# EAGLE design ESPLed (EAGLE 8.2.2)
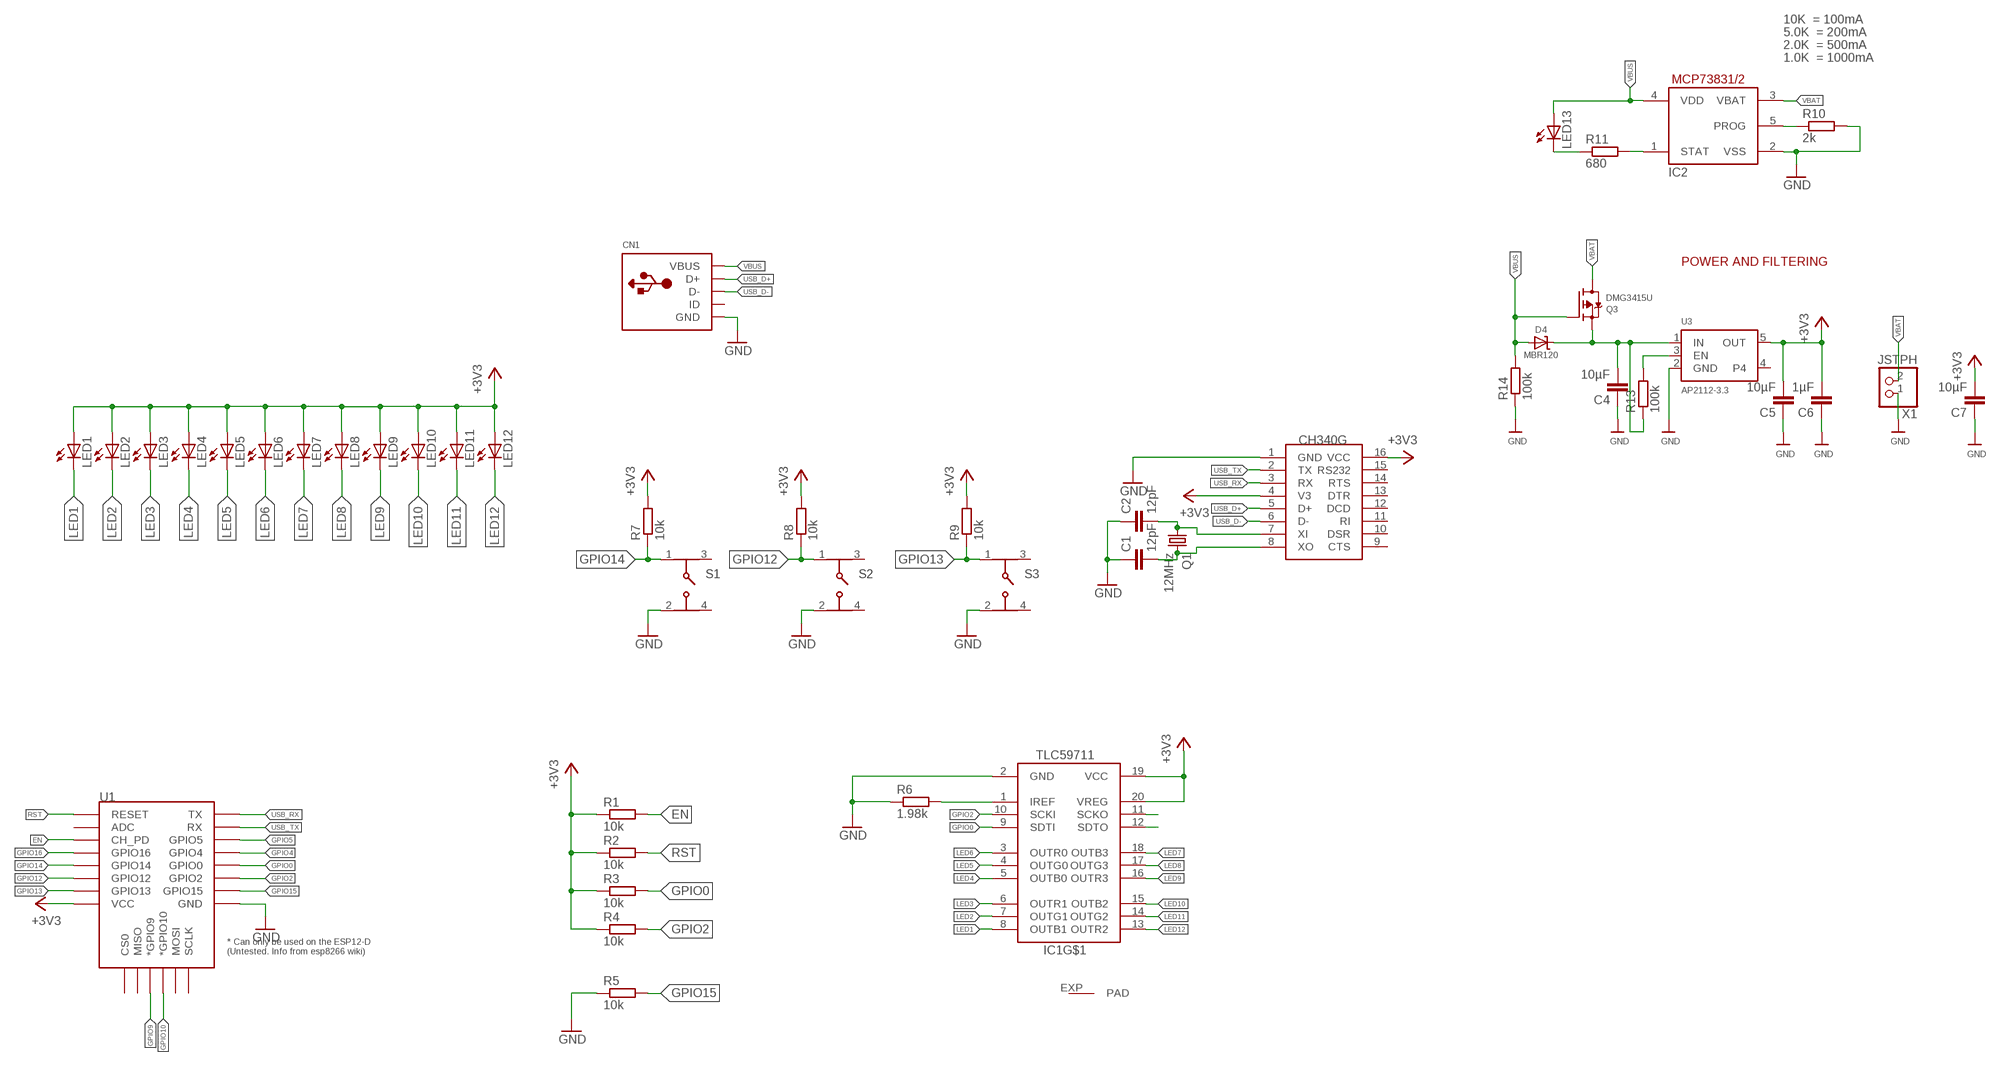
[diagram p0: schematic, sheet 1]

## Parts
C1  12pF  C-EUC0805  [C0805]
C2  12pF  C-EUC0805  [C0805]
C4  10µF  C-EUC0805  [C0805]
C5  10µF  C-EUC0805  [C0805]
C6  1µF  C-EUC0805  [C0805]
C7  10µF  C-EUC0805  [C0805]
CN1  USBMINIB  [USB-MINIB]
D4  MBR120  DIODE-SCHOTTKYSOD-123  [SOD-123]
IC1  TLC59711  [HTSSOP20DAP]
IC2  MCP73831/OT  [SOT23-5L]
LED1  LEDSML0805  [SML0805]
LED2  LEDSML0805  [SML0805]
LED3  LEDSML0805  [SML0805]
LED4  LEDSML0805  [SML0805]
LED5  LEDSML0805  [SML0805]
LED6  LEDSML0805  [SML0805]
LED7  LEDSML0805  [SML0805]
LED8  LEDSML0805  [SML0805]
LED9  LEDSML0805  [SML0805]
LED10  LEDSML0805  [SML0805]
LED11  LEDSML0805  [SML0805]
LED12  LEDSML0805  [SML0805]
LED13  LEDSML0805  [SML0805]
Q1  12MHz  CX5032GB12000H0PESZZ  [CX5032GB]
Q3  DMG3415U  MOSFET-P  [SOT23-R]
R1  10k  R-EU_R0805  [R0805]
R2  10k  R-EU_R0805  [R0805]
R3  10k  R-EU_R0805  [R0805]
R4  10k  R-EU_R0805  [R0805]
R5  10k  R-EU_R0805  [R0805]
R6  1.98k  R-EU_R0805  [R0805]
R7  10k  R-EU_R0805  [R0805]
R8  10k  R-EU_R0805  [R0805]
R9  10k  R-EU_R0805  [R0805]
R10  2k  R-EU_R0805  [R0805]
R11  680  R-EU_R0805  [R0805]
R13  100k  R-EU_R0805  [R0805]
R14  100k  R-EU_R0805  [R0805]
S1  4301X6XXX7X6_430156043726  [4301X6XXX7X6]
S2  4301X6XXX7X6_430156043726  [4301X6XXX7X6]
S3  4301X6XXX7X6_430156043726  [4301X6XXX7X6]
U1  ESP12ESMD  [ESP12E-SMD]
U3  AP2112-3.3  VREG_SOT23-5  [SOT23-5]
U$1  CH340G  [SOIC16]
X1  JSTPH  CON_JST_PH_2PIN  [JSTPH2]

## Nets
+3V3: C5.2 C6.2 C7.2 IC1.19(VCC) IC1.20(VREG) LED1.A LED2.A LED3.A LED4.A LED5.A LED6.A LED7.A LED8.A LED9.A LED10.A LED11.A LED12.A R1.1 R2.1 R3.1 R4.1 R7.2 R8.2 R9.2 U1.VCC U3.5(OUT) U$1.4(V3) U$1.16(VCC)
EN: R1.2 U1.CH_PD
GND: C1.1 C2.1 C4.1 C5.1 C6.1 C7.1 CN1.GND IC1.2(GND) IC2.2(VSS) R5.1 R6.1 R10.2 R14.1 S1.2 S2.2 S3.2 U1.GND U3.2(GND) U$1.1(GND) X1.1
GPIO0: IC1.9(SDTI) R3.2 U1.GPIO0
GPIO2: IC1.10(SCKI) R4.2 U1.GPIO2
GPIO4: U1.GPIO4
GPIO5: U1.GPIO5
GPIO9: U1.GPIO9(*GPIO9)
GPIO10: U1.GPIO10(*GPIO10)
GPIO12: R8.1 S2.1 U1.GPIO12
GPIO13: R9.1 S3.1 U1.GPIO13
GPIO14: R7.1 S1.1 U1.GPIO14
GPIO15: R5.2 U1.GPIO15
GPIO16: U1.GPIO16
IN: C4.2 D4.C Q3.2(S) R13.1 U3.1(IN)
IREF: IC1.1(IREF) R6.2
LED1: IC1.8(OUTB1) LED1.C
LED2: IC1.7(OUTG1) LED2.C
LED3: IC1.6(OUTR1) LED3.C
LED4: IC1.5(OUTB0) LED4.C
LED5: IC1.4(OUTG0) LED5.C
LED6: IC1.3(OUTR0) LED6.C
LED7: IC1.18(OUTB3) LED7.C
LED8: IC1.17(OUTG3) LED8.C
LED9: IC1.16(OUTR3) LED9.C
LED10: IC1.15(OUTB2) LED10.C
LED11: IC1.14(OUTG2) LED11.C
LED12: IC1.13(OUTR2) LED12.C
N$1: LED13.C R11.1
N$14: IC1.12(SDTO)
N$15: IC1.11(SCKO)
PROG: IC2.5(PROG) R10.1
RST: R2.2 U1.RESET
STAT: IC2.1(STAT) R11.2
USB_D+: CN1.D+ U$1.5(D+)
USB_D-: CN1.D- U$1.6(D-)
USB_RX: U1.TXD0(TX) U$1.3(RX)
USB_TX: U1.RXD0(RX) U$1.2(TX)
VBAT: IC2.3(VBAT) Q3.3(D) X1.2
VBUS: CN1.VBUS D4.A IC2.4(VDD) LED13.A Q3.1(G) R14.2
VREG_EN: R13.2 U3.3(EN)
XI: C2.2 Q1.P$1 U$1.7(XI)
XO: C1.2 Q1.P$2 U$1.8(XO)
Unconnected: CN1.ID IC1.EXP(PAD) S1.3 S1.4 S2.3 S2.4 S3.3 S3.4 U1.ADC U1.CS0 U1.MISO U1.MOSI U1.SCLK U3.4 U$1.9(CTS) U$1.10(DSR) U$1.11(RI) U$1.12(DCD) U$1.13(DTR) U$1.14(RTS) U$1.15(RS232)

## Notes on the sheet
- 10K  = 100mA
- 5.0K  = 200mA
- 2.0K  = 500mA
- 1.0K  = 1000mA
- POWER AND FILTERING

## Library data of the parts
C1 C2 C4-C7 = resistor:C-EU: CAPACITOR, European symbol
CN1 = adafruit:USB: USB Connectors USBMINIB - Surface Mount Female Mini-B USB Connector 4UConnector: 06564 By microbuilder.eu Thru-hole RA Female Mini-B USB Connector 4UConnector: 18732 By ladyada.net
D4 = microbuilder:DIODE-SCHOTTKY
IC1 = adafruit:TLC59711
IC2 = adafruit:MCP73831: MCP73831/2 Miniature Single-Cell, Fully Integrated Li-Ion, Li-Polymer Charge Management Controllers. Nice and small simple lipoly charge controller, with adjustable current and status output (LED) http://www.ladyada.net/library/pcb/eaglelibrary.html
LED1-LED13 = led:LED: LED OSRAM: - CHIPLED LG R971, LG N971, LY N971, LG Q971, LY Q971, LO R971, LY R971 LH N974, LH R974 LS Q976, LO Q976, LY Q976 LO Q996 - Hyper CHIPLED LW Q18S LB Q993, LB Q99A, LB R99A - SideLED LS A670, LO A670, LY A670, LG A670, LP A670 LB A673, LV A673, LT A673, LW A673 LH A674 LY A675 LS A676, LA A676, LO A676, LY A676, LW A676 LS A679, LY A679, LG A679 - Hyper Micro SIDELED® LS Y876, LA Y876, LO Y876, LY Y876 LT Y87S - SmartLED LW L88C, LW L88S LB L89C, LB L89S, LG L890 LS L89K, LO L89K, LY L89K LS L896, LA L896, LO L896, LY L896 - TOPLED LS T670, LO T670, LY T670, LG T670, LP T670 LSG T670, LSP T670, LSY T670, LOP T670, LYG T670 LG T671, LOG T671, LSG T671 LB T673, LV T673, LT T673, LW T673 LH T674 LS T676, LA T676, LO T676, LY T676, LB T676, LH T676, LSB T676, LW T676 LB T67C, LV T67C, LT T67C, LS T67K, LO T67K, LY T67K, LW E67C LS E67B, LA E67B, LO E67B, LY E67B, LB E67C, LV E67C, LT E67C LW T67C LS T679, LY T679, LG T679 LS T770, LO T770, LY T770, LG T770, LP T770 LB T773, LV T773, LT T773, LW T773 LH T774 LS E675, LA E675, LY E675, LS T675 LS T776, LA T776, LO T776, LY T776, LB T776 LHGB T686 LT T68C, LB T68C - Hyper Mini TOPLED® LB M676 - Mini TOPLED Santana® LG M470 LS M47K, LO M47K, LY M47K Source: http://www.osram.convergy.de LUXEON: - LUMILED® LXK2-PW12-R00, LXK2-PW12-S00, LXK2-PW14-U00, LXK2-PW14-V00 LXK2-PM12-R00, LXK2-PM12-S00, LXK2-PM14-U00 LXK2-PE12-Q00, LXK2-PE12-R00, LXK2-PE12-S00, LXK2-PE14-T00, LXK2-PE14-U00 LXK2-PB12-K00, LXK2-PB12-L00, LXK2-PB12-M00, LXK2-PB14-N00, LXK2-PB14-P00, LXK2-PB14-Q00 LXK2-PR12-L00, LXK2-PR12-M00, LXK2-PR14-Q00, LXK2-PR14-R00 LXK2-PD12-Q00, LXK2-PD12-R00, LXK2-PD12-S00 LXK2-PH12-R00, LXK2-PH12-S00 LXK2-PL12-P00, LXK2-PL12-Q00, LXK2-PL12-R00 Source: www.luxeon.com KINGBRIGHT: KA-3528ASYC Source: www.kingbright.com
Q1 = JonasLib:CX5032GB12000H0PESZZ
Q3 = microbuilder:MOSFET-P: P-Channel Mosfet LEGEND VDS: Voltage Drain-Source ID: Drain Current RDS(ON): Drain-Source On-State Resistance VGS(TH): Gate-Source Threshold Voltage CISS: Drain-Source Input Capacitance SOT-23 Name VDS ID RDS(ON) VGS(TH) CISS Order Number IRLML5103 30V 760mA 600 mOhm -- 75pF @ 25V Digikey: IRLML5103PBFCT-ND IRLML6401 12V 4.3A 50 mOhm 950mV @ 250µA 830pF @ 10V Digikey: IRLML6401PBFTR-ND NTR0202PL 20V 400mA 800 mOhm 2.3V @ 250uA 70pF @ 5V Digikey: NTR0202PLT1GOSTR-ND NTR4101PT1G 20V 1.8A 85 mOhm 1.2V @ 250uA 675pF @ 10V Digikey: NTR4101PT1GOSCT-ND DMP2004K 20V 600mA 900 mOhm 1V @ 250uA 175pF @ 16V Digikey: DMP2004KDICT-ND PMV65XP 20V 3.9A 76 mOhm 950mV @ 1mA 725pF @ 20V Digikey: 568-2358-2-ND TO-252 Name VDS ID RDS(ON) VGS(TH) CISS Order Number AOD417 30V 25A 34 mOhm 3V @ 250µA 920pF @ 15V Digikey: 785-1106-2-ND PowerPak Name VDS ID RDS(ON) VGS(TH) CISS Order Number AON7401 30V 12A 14 mOhm 3V @ 250µA 2600pF @ 15V Digikey: 785-1302-1-ND
R1-R11 R13 R14 = resistor:R-EU_: RESISTOR, European symbol
S1-S3 = Wurth_Elektronik_Electromechanic_Switch_rev17b:4301X6XXX7X6: WS-TATV 6x6mm Switch, THT version Specification Rating:50mA, 12VDC Contact Resistance Initial:100mΩ max. After life test: 20mΩ max. Insulation Resistance: min.100MΩ at 500VDC Dielectric Strength : 250VAC for 1 minute Stroke: :0.25 + 0.2 mm / - 0.1 mm Bounce:10ms max. Material Cover : : Stainless Steel Stem: LCP UL 94V-0 Frame: PA9T UL 94V-0, color Black Contact: Stainless Steel with silver Terminal: Brass with silver plating <http://katalog.we-online.de/media/images/v2/Family_WS_TST_THT_4301x6xxx7x6_pf2.jpg> Details see: http://katalog.we-online.de/em/datasheet/4301x6xxx7x6.pdf 2016 (C) Wurth Elektronik
U1 = esp8266modules:ESP12E: ESP12E Module
U3 = microbuilder:VREG_SOT23-5: SOT23-5 Fixed Voltage Regulators Part Current Out V Out V In V Dropout θJA (°C/W) TJ (°C) Digikey Part No. ADP121 150mA 3.3V 3.4-5.5V 0.09V @ 150mA -- -- ADP121-AUJZ33R7CT-ND ADP121 150mA 3.0V 3.1-5.5V 0.09V @ 150mA -- -- ADP121-AUJZ30R7CT-ND ADP122 300mA 3.3V 3.4-5.5V 0.085V @ 300mA -- -- ADP122AUJZ-3.3-R7CT-ND ADP1712 300mA 3.3V 3.5-5.5V 0.17V @ 300mA -- -- ADP1712AUJZ-3.3-R7TR-ND AP7311 (Low Cost) 150mA 3.3V 3.5-6V 0.15V @ 150mA -- -- AP7311-33WG-7DICT-ND LD39015M18R 150mA 1.8V 1.9V-5.5V 0.08V @ 100mA -- -- 497-6977-1-ND LP2985A-33DBVR 150mA 3.3V 3.3-16V 0.28V @ 150mA 206 150 296-18479-1-ND MCP1824T-3302E/OT 300mA 3.3V 3.5V-6V 0.2V @ 300mA -- -- MCP1824T-3302E/OTCT-ND MIC5205-2.5YM5 TR 150mA 2.5V 2.7-16V 0.165V @ 150mA -- -- 576-1257-2-ND MIC5205-3.0YM5 TR 150mA 3.0V 3.2V-16V 0.165V @ 150mA -- -- 576-1258-2-ND MIC5205-3.3YM5 TR 150mA 3.3V 3.5V-16V 0.165V @ 150mA -- -- 576-1259-2-ND TPS780330220 150mA 3.3V+2.2V 3.6-5.5V 250mV Max -- -- 296-23332-1-ND TDA3663/N1,135 100mA 3.3V 3.5-45V 0.18V @ 50mA -- -- 568-5343-1-ND Max operating temp can be calculated using θJA, TJ (max junction temperature), and power in watts. Set the "Maximum Ambient Temperature" until it reaches TJ ("Max Junction Temperature"), which is the absolute limit for safe use of the regulator: Heat Sink Temperature Calculator <http://www.daycounter.com/Calculators/Heat-Sink-Temperature-Calculator.phtml> For example, With 12V source into a 3.3V LP2985 and a 30mA load, we are dissipating (12V-3.3V) * 0.03A = 0.261W. With a θJA of 206 °C/W, a TJ of 150°C, and 261mW we can safely use the chip without a heat sink up to 75°C (=147.1°C Junction Temperature).
U$1 = ch340g:CH340G
X1 = microbuilder:CON_JST_PH_2PIN: JST 2-Pin Right-Angle Connector PH-Series - 4UConnector: 17311 SH-Series - 4UConnector: 07278

## Board
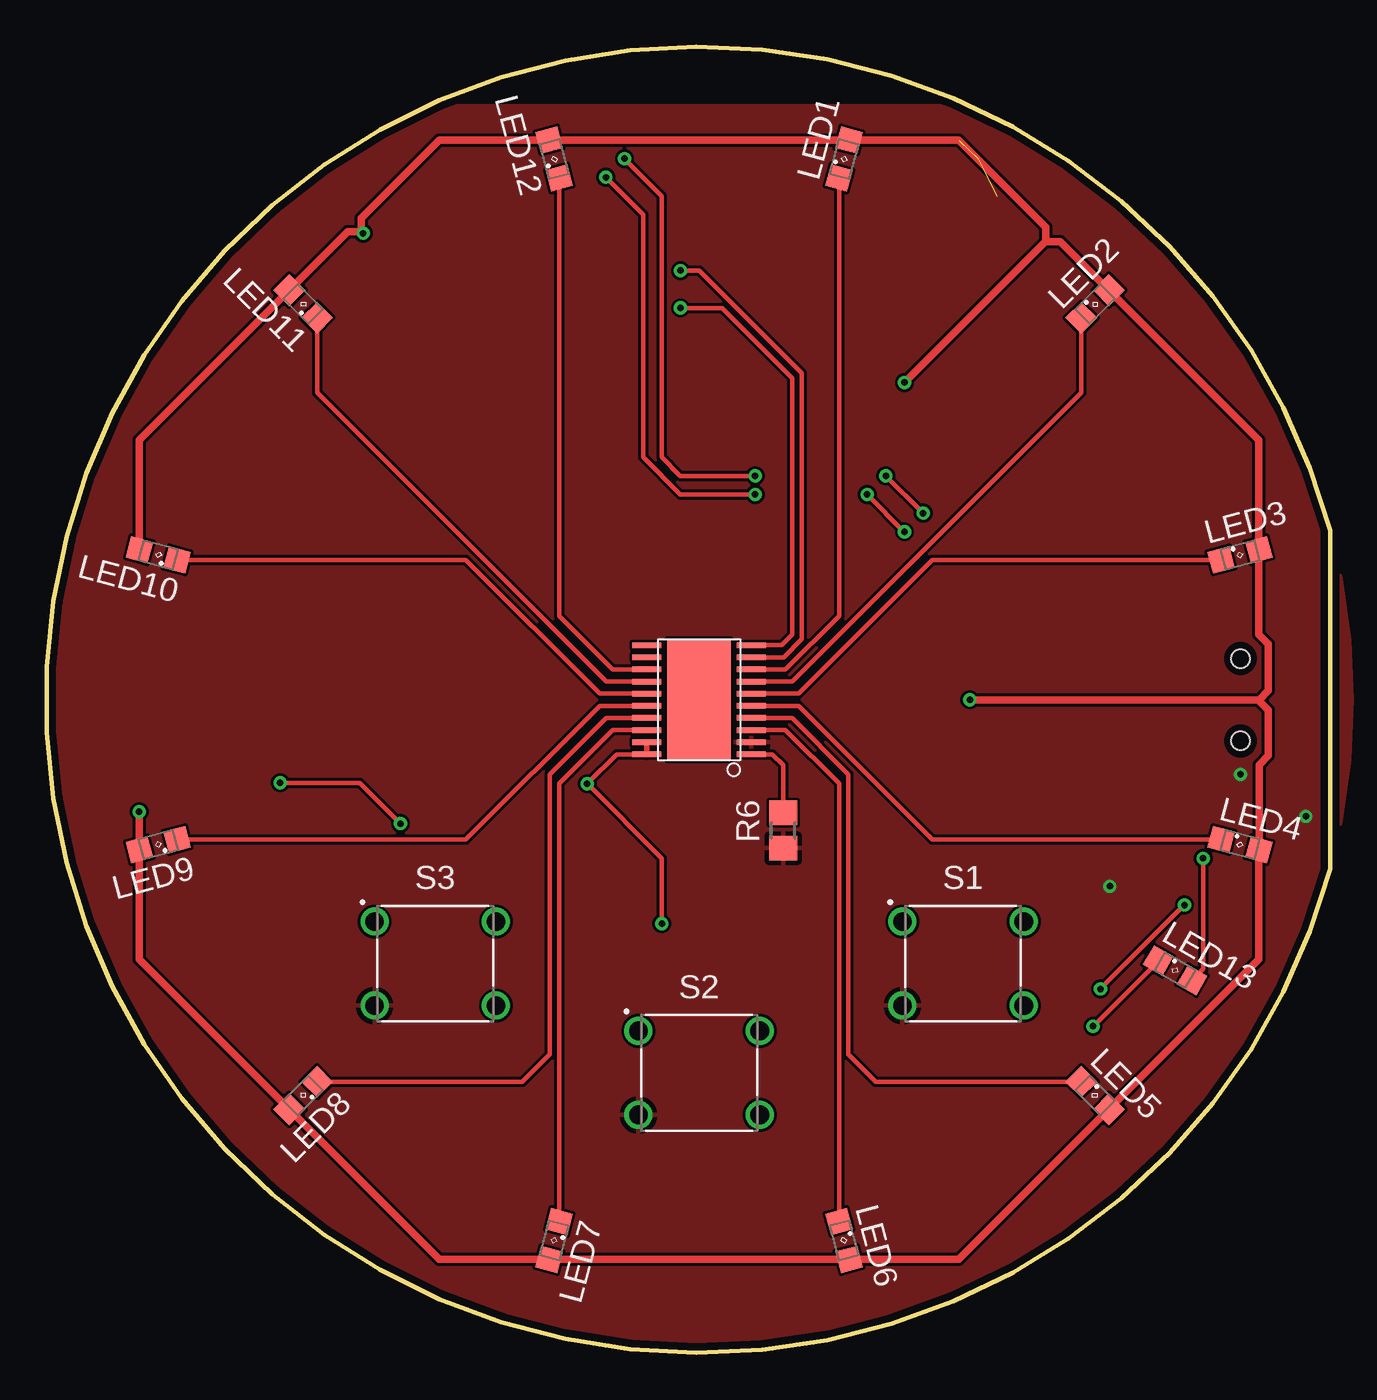
[diagram p1: board, top side]
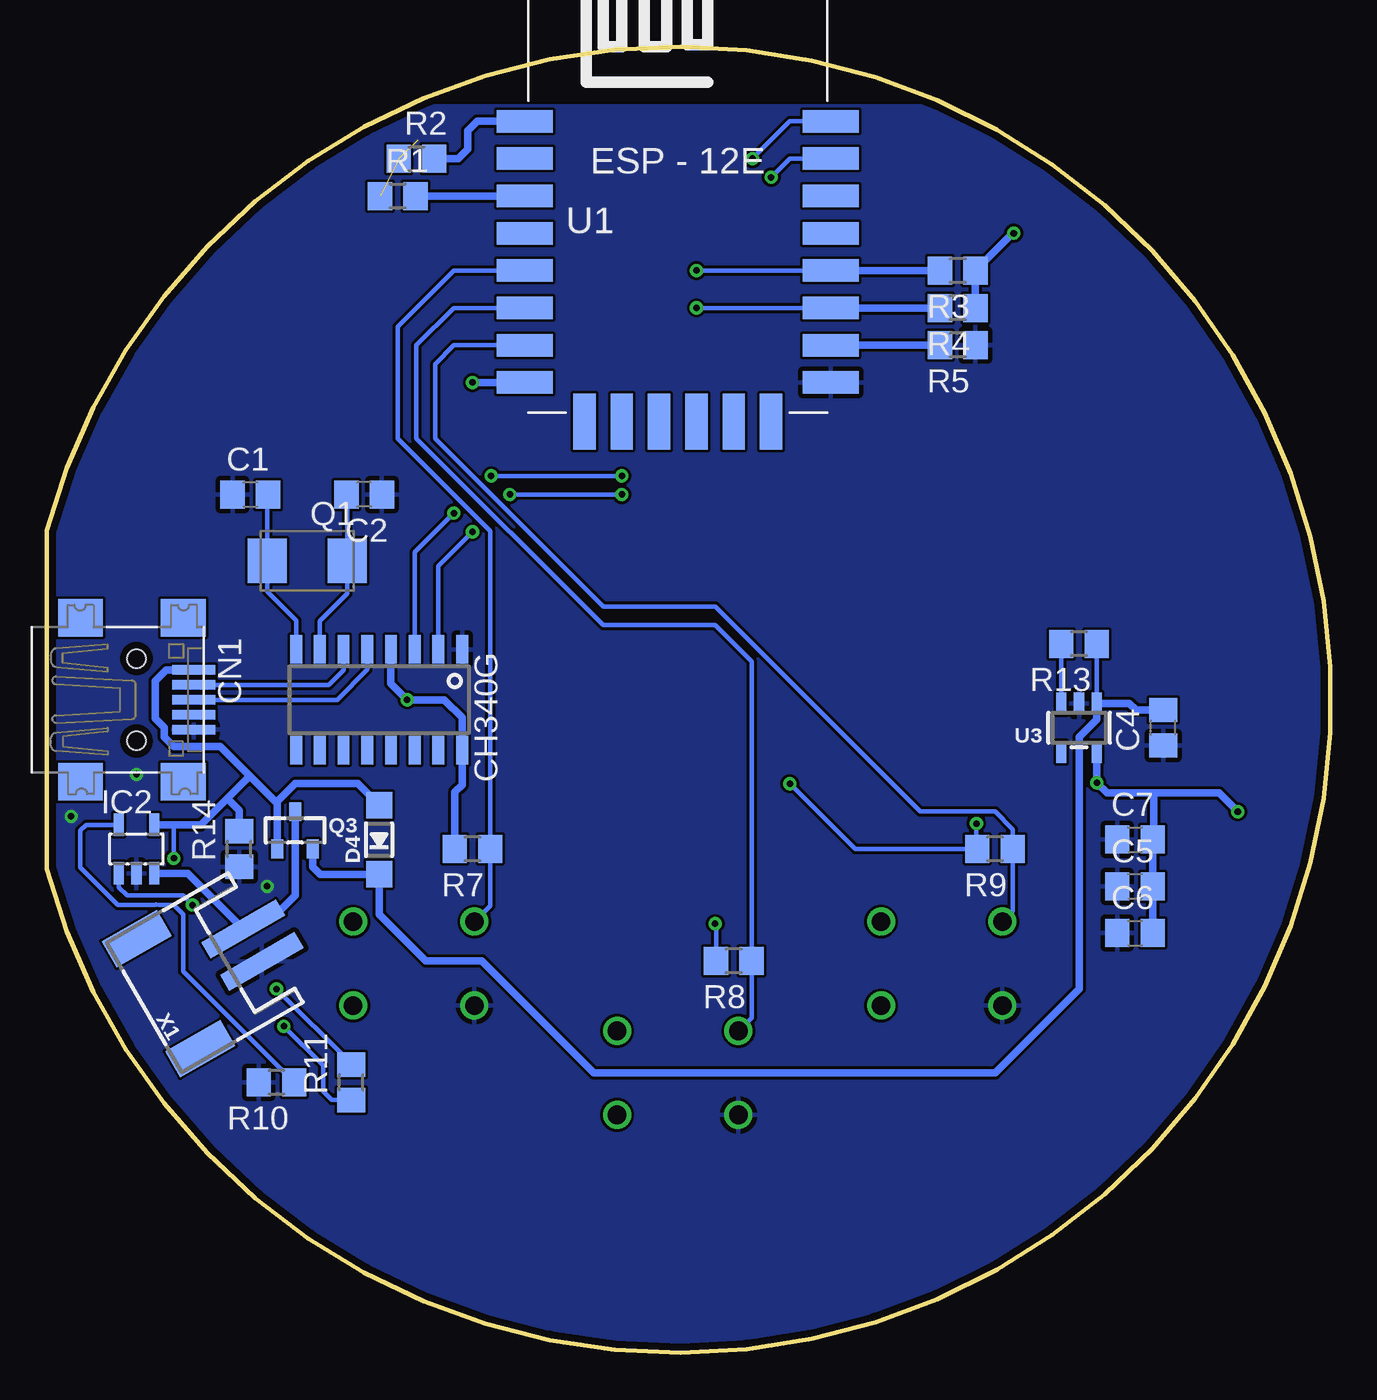
[diagram p2: board, bottom side, seen from below]

Size 68.77 x 70 mm. Coordinates in mm from the lower left corner, seen from the top.
Outline: 68.77,25.94 arc-330 68.77,44.06 68.77,25.94
Copper layers (1*16): Top 0.0356mm / dielectric 1.5011mm / Bottom 0.0356mm
Design rules "LaenPCBOrder": minimum track width 6mil, minimum drill 13mil, track to track 6mil, track to pad 6mil, pad to pad 6mil, via to via 6mil, smd to smd 6mil, copper to edge 15mil, drill to drill 6mil, minimum pad ring 7mil, minimum via ring 7mil, stop-mask expansion 3mil, vias tented up to drill 0mil, thermal gap 10mil

### Footprints (pad centres in the part's own frame; a part is rotated, then mirrored left to right if it is on the bottom)
C0805 = smd 1.3 x 1.5: 1 -0.95,0; 2 0.95,0
USB-MINIB = smd 0.5 x 2.308: D+ 0,4.064; D- -0.8,4.064; GND 1.6,4.064; ID 0.8,4.064; VBUS -1.6,4.064 | smd 2 x 2.4: GND1 -4.4,-2; GND2 -4.4,3.5; GND3 4.4,3.5; GND4 4.4,-2 | hole 1: -2.2,1; 2.2,1
SOD-123 = smd 1.4 x 1.4: A 1.85,0; C -1.85,0
HTSSOP20DAP = smd 0.3 x 1.55: 1 -2.925,-2.8; 2 -2.275,-2.8; 3 -1.625,-2.8; 4 -0.975,-2.8; 5 -0.325,-2.8; 6 0.325,-2.8; 7 0.975,-2.8; 8 1.625,-2.8; 9 2.275,-2.8; 10 2.925,-2.8; 11 2.925,2.8; 12 2.275,2.8; 13 1.625,2.8; 14 0.975,2.8; 15 0.325,2.8; 16 -0.325,2.8; 17 -0.975,2.8; 18 -1.625,2.8; 19 -2.275,2.8; 20 -2.925,2.8 | smd 6.5 x 3.4: EXP 0,0
SOT23-5L = smd 0.55 x 1.2: 1 -0.95,-1.3; 2 0,-1.3; 3 0.95,-1.3; 4 0.95,1.3; 5 -0.95,1.3
SML0805 = smd 1.2 x 1.2: A 1.05,0; C -1.05,0
CX5032GB = smd 2.1 x 2.4: P$1 -2.15,0; P$2 2.15,0
SOT23-R = smd 0.635 x 1.016: 1 -0.95,-1; 2 0.95,-1; 3 0,1
R0805 = smd 1.3 x 1.5: 1 -0.95,0; 2 0.95,0
4301X6XXX7X6 = drill 1: 1 -3.25,2.25; 2 -3.25,-2.25; 3 3.25,2.25; 4 3.25,-2.25
ESP12E-SMD = smd 3 x 1.2: ADC -8.2,4; CH_PD -8.2,2; GND 8.2,-8; GPIO0 8.2,-2; GPIO2 8.2,-4; GPIO4 8.2,0; GPIO5 8.2,2; GPIO12 -8.2,-4; GPIO13 -8.2,-6; GPIO14 -8.2,-2; GPIO15 8.2,-6; GPIO16 -8.2,0; RESET -8.2,6; RXD0 8.2,4; TXD0 8.2,6; VCC -8.2,-8 | smd 1.2 x 3: CS0 -5,-10.1; GPIO9 -1,-10.1; GPIO10 1,-10.1; MISO -3,-10.1; MOSI 3,-10.1; SCLK 5,-10.1
SOT23-5 = smd 0.55 x 1.2: 1 -0.95,-1.3; 2 0,-1.3; 3 0.95,-1.3; 4 0.95,1.3; 5 -0.95,1.3
SOIC16 = smd 0.635 x 1.524: 1 -4.445,-2.695; 2 -3.175,-2.695; 3 -1.905,-2.695; 4 -0.635,-2.695; 5 0.635,-2.695; 6 1.905,-2.695; 7 3.175,-2.695; 8 4.445,-2.695; 9 4.445,2.695; 10 3.175,2.695; 11 1.905,2.695; 12 0.635,2.695; 13 -0.635,2.695; 14 -1.905,2.695; 15 -3.175,2.695; 16 -4.445,2.695
JSTPH2 = smd 1 x 4.6: 1 -1,-3.7; 2 1,-3.7 | smd 1.6 x 3.4: NC1 -3.4,1.5; NC2 3.4,1.5

### Placement (x,y rotation side)
C1  57.86,46 0 bottom
C2  51.76,46 180 bottom
C4  8.96,33.5 90 bottom
C5  10.46,25 0 bottom
C6  10.46,22.5 0 bottom
C7  10.46,27.5 0 bottom
CN1  64.96,35 270 bottom
D4  50.96,27.5 90 bottom
IC1  34.96,35 90 top
IC2  63.96,27 0 bottom
LED1  42.72,63.98 75 top
LED2  56.17,56.21 45 top
LED3  63.93,42.77 15 top
LED4  63.93,27.24 345 top
LED5  56.17,13.79 315 top
LED6  42.72,6.02 285 top
LED7  27.19,6.02 255 top
LED8  13.74,13.79 225 top
LED9  5.98,27.24 195 top
LED10  5.98,42.77 165 top
LED11  13.74,56.21 135 top
LED12  27.19,63.98 105 top
LED13  60.46,20.5 330 top
Q1  54.81,42.45 180 bottom
Q3  55.46,28 0 bottom
R1  49.96,62 0 bottom
R2  48.96,64 0 bottom
R3  19.96,58 180 bottom
R4  19.96,56 180 bottom
R5  19.96,54 180 bottom
R6  39.46,28 90 top
R7  45.96,27 180 bottom
R8  31.96,21 180 bottom
R9  17.96,27 180 bottom
R10  56.46,14.5 180 bottom
R11  52.46,14.5 90 bottom
R13  13.46,38 180 bottom
R14  58.46,27 90 bottom
S1  49.1,20.86 0 top
S2  34.96,15 0 top
S3  20.82,20.86 0 top
U1  34.96,60 0 bottom
U3  13.46,33.5 180 bottom
U$1  50.96,35 180 bottom
X1  60.94,20 120 bottom

### Tracks (layer width: path | path; a pad name or v marks a point on that pad's centre or on a via)
+3V3  (via drill 0.35)  (2 unrouted)
  Top 0.254: IC1.20 30.53,32.08 v28.96,30.5 32.96,26.5 v32.96,23 | v18.96,28.37 16.77,30.55 v12.51,30.55
  Top 0.305: IC1.19 IC1.20
  Top 0.406: LED10.A 4.96,48.92 LED11.A 16.12,60.08 16.88,60.08 v16.96,60 16.86,60.1 16.86,60.81 21.04,64.99 LED12.A LED1.A 48.87,64.99 53.53,60.34 53.53,59.57 | v4.96,29 LED9.A 4.96,21.08 LED8.A 21.04,5.01 LED7.A LED6.A 48.87,5.01 LED5.A 64.95,21.08 LED4.A 64.96,31.5 65.46,32 65.46,34.44 64.96,34.94 64.96,35 | 64.96,35 65.46,35.5 65.46,38 64.95,38.51 LED3.A 64.95,48.92 LED2.A 54.31,59.55 53.55,59.55 53.53,59.57 | 64.96,35 v49.46,35 | v45.96,52 53.53,59.57
  Bottom 0.254: v28.96,30.5 25.46,27 R9.2 18.96,27.05 v18.96,28.37 | v32.96,23 32.91,22.95 R8.2
  Bottom 0.406: U$1.4 50.32,35.87 v49.46,35 47.46,35 46.51,34.06 U$1.16 46.51,30.45 46.91,30.05 R7.2 | U3.5 v12.51,30.55 11.96,30 9.45,30 | 9.45,30 5.96,30 v4.96,29 | U1.VCC v45.96,52 | R4.1 R3.1 17.01,60 v16.96,60 | C6.2 C5.2 C7.2 9.45,27.56 9.45,30
EN
  Bottom 0.406: R1.2 U1.CH_PD
GND  (via drill 0.35)
  other vias: 56.96,25 63.96,31 67.46,28.75
  pour Bottom: 34.96,0 arc-90 -0.04,35 arc-90 34.96,70 arc-90 69.96,35 arc-90
  pour Top: -0.04,35 arc-90 34.96,70 arc-90 69.96,35 arc-90 34.96,0 arc-90
  cutout Top: 18.96,67 50.96,67 50.96,76 18.96,76
  cutout Bottom: 18.96,76 50.96,76 50.96,67 18.96,67
GPIO0  (via drill 0.35)
  Top 0.254: v33.96,58 34.96,58 40.46,52.5 40.46,38.25 39.48,37.28 IC1.9
  Bottom 0.254: v33.96,58 U1.GPIO0
  Bottom 0.406: U1.GPIO0 R3.2
GPIO2  (via drill 0.35)
  Top 0.254: v33.96,56 36.21,56 39.96,52.25 39.96,38.5 39.38,37.93 IC1.10
  Bottom 0.254: U1.GPIO2 v33.96,56
  Bottom 0.406: R4.2 U1.GPIO2
GPIO12
  Bottom 0.254: S2.1 31.01,17.95 R8.1 31.01,37.05 32.96,39 38.96,39 48.96,49 48.96,54 46.96,56 U1.GPIO12
GPIO13
  Bottom 0.254: R9.1 17.01,23.67 S3.1 | U1.GPIO13 46.96,54 47.96,53 47.96,49 38.96,40 32.96,40 21.96,29 17.96,29 17.01,28.05 R9.1 | 16.96,27.05 R9.1
GPIO14
  Bottom 0.254: S1.1 45.01,23.95 R7.1 45.01,44.05 49.96,49 49.96,55 46.96,58 U1.GPIO14
GPIO15
  Bottom 0.406: U1.GPIO15 R5.2
IN
  Bottom 0.254: R13.1 U3.1
  Bottom 0.406: C4.2 10.41,34.45 10.76,34.8 U3.1 12.51,33.95 13.46,33 13.46,19.5 17.96,15 39.46,15 45.46,21 48.46,21 50.96,23.5 D4.C 54.11,25.65 54.51,26.05 Q3.2
IREF
  Top 0.254: IC1.1 38.88,32.08 39.46,31.5 R6.2
LED1
  Top 0.254: IC1.8 39.58,36.63 42.45,39.49 LED1.C
LED2
  Top 0.254: IC1.7 39.93,35.98 55.43,51.47 LED2.C
LED3
  Top 0.254: IC1.6 40.28,35.33 47.45,42.49 LED3.C
LED4
  Top 0.254: LED4.C 47.45,27.51 40.28,34.68 IC1.5
LED5
  Top 0.254: IC1.4 39.93,34.03 42.96,31 42.96,16 44.43,14.53 LED5.C
LED6
  Top 0.254: IC1.3 39.58,33.38 42.45,30.51 LED6.C
LED7
  Top 0.254: IC1.18 30.33,33.38 27.46,30.51 LED7.C
LED8
  Top 0.254: IC1.17 29.98,34.03 26.96,31 26.96,16 25.48,14.53 LED8.C
LED9
  Top 0.254: IC1.16 29.63,34.68 22.46,27.51 LED9.C
LED10
  Top 0.254: IC1.15 29.63,35.33 22.46,42.49 LED10.C
LED11
  Top 0.254: IC1.14 29.98,35.98 14.48,51.47 LED11.C
LED12
  Top 0.254: IC1.13 30.33,36.63 27.46,39.49 LED12.C
N$1  (via drill 0.35)
  Top 0.254: LED13.C 59.55,20.99 v56.06,17.5
  Bottom 0.254: v56.06,17.5 53.96,15.4 53.96,14 53.51,13.55 R11.1
PROG
  Bottom 0.254: IC2.5 66.66,28.3 66.96,28 66.96,26 64.96,24.01 62.96,24.01 62.9,24.04 62.76,24 61.96,24 61.46,23.5 61.46,20.45 R10.1
RST
  Bottom 0.406: R2.2 46.71,64 46.21,64.5 46.21,65.5 45.71,66 U1.RESET
STAT  (via drill 0.35)
  Top 0.254: v56.46,19.5 v60.96,24
  Bottom 0.254: R11.2 52.46,15.5 v56.46,19.5 | v60.96,24 61.46,24.5 64.46,24.5 64.91,24.95 IC2.1
USB_D+
  Bottom 0.254: CN1.D+ 53.21,35 51.59,36.62 U$1.5
USB_D-
  Bottom 0.254: CN1.D- 53.66,35.8 52.86,36.6 U$1.6
USB_RX  (via drill 0.35)
  Top 0.254: v46.96,45 v44.96,47 | v37.96,47 33.96,47 32.96,48 32.96,62 v30.96,64
  Bottom 0.254: U$1.3 49.05,42.91 v46.96,45 | v44.96,47 v37.96,47 | v30.96,64 28.96,66 U1.TXD0
USB_TX  (via drill 0.35)
  Top 0.254: v37.96,46 33.96,46 31.96,48 31.96,61 v29.96,63 | v43.96,46 v45.96,44
  Bottom 0.254: U1.RXD0 28.96,64 v29.96,63 | v37.96,46 v43.96,46 | v45.96,44 47.78,42.18 U$1.2
VBAT
  Bottom 0.406: Q3.3 55.46,24.5 56.46,23.5 57.45,23.5 X1.2 61.22,25.7 IC2.3
VBUS  (via drill 0.35)
  Top 0.254: LED13.A 61.96,20.57 v61.96,26.5
  Bottom 0.254: v61.96,26.5 61.96,28.22 62.04,28.3
  Bottom 0.406: 56.41,29.45 Q3.1 | 57.88,30.93 56.41,29.45 | 57.88,30.93 59.46,32.5 61.96,32.5 62.46,33 62.46,33.5 62.96,34 62.96,36 62.36,36.6 CN1.VBUS | D4.A 52.11,30.5 55.46,30.5 56.41,29.55 56.41,29.45 | IC2.4 62.04,28.3 60.51,28.3 59.09,29.72 | 59.09,29.72 57.88,30.93 | R14.2 58.46,29.08 59.09,29.72
VREG_EN
  Bottom 0.254: U3.3 R13.2
XI
  Bottom 0.254: U$1.7 54.13,39.23 52.66,40.7 Q1.P$1 52.66,45.95 C2.2
XO
  Bottom 0.254: U$1.8 55.4,39.25 56.96,40.8 Q1.P$2 56.96,45.95 C1.2